# Altium schematic sheet v1.0.SchDoc
size 266 x 111 mm
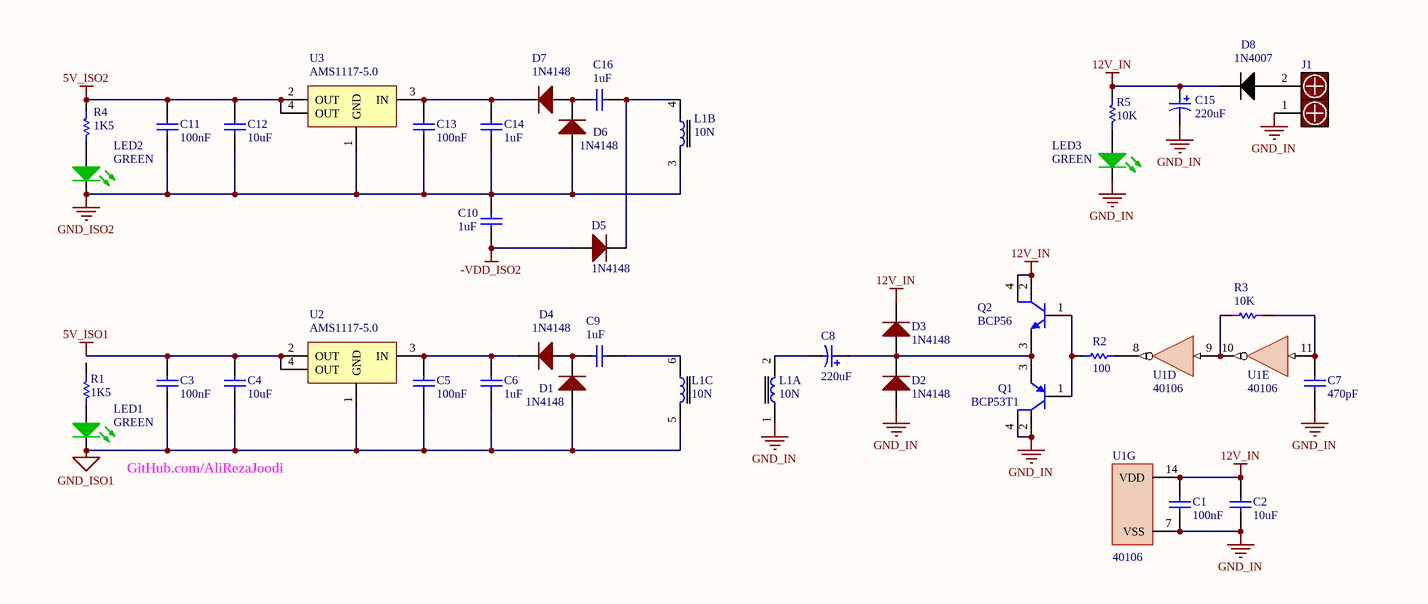
[diagram p0: v1.0.SchDoc]

## Parts
C1  100nF  [SMD_0805]
C2  10uF  [SMD_0805]
C3  100nF  [SMD_0805]
C4  10uF  [SMD_0805]
C5  100nF  [SMD_0805]
C6  1uF  [SMD_0805]
C7  470pF  [SMD_0805]
C8  220uF  [THD_P3.4/D8/H12]
C9  1uF  [SMD_0805]
C10  1uF  [SMD_0805]
C11  100nF  [SMD_0805]
C12  10uF  [SMD_0805]
C13  100nF  [SMD_0805]
C14  1uF  [SMD_0805]
C15  220uF  [THD_P3.4/D8/H12]
C16  1uF  [SMD_0805]
D1  1N4148  [SMD_DO-213AA]
D2  1N4148  [SMD_DO-213AA]
D3  1N4148  [SMD_DO-213AA]
D4  1N4148  [SMD_DO-213AA]
D5  1N4148  [SMD_DO-213AA]
D6  1N4148  [SMD_DO-213AA]
D7  1N4148  [SMD_DO-213AA]
D8  1N4007  [SMD_SOD123W]
J1  (no value)  [1x2_P8.26]
L1  10N  [TOROIDS_DO25/DI15/L13]  (parts A,B,C of 3)
LED1  GREEN  [SMD_0805_GREEN]
LED2  GREEN  [SMD_0805_GREEN]
LED3  GREEN  [SMD_0805_GREEN]
Q1  BCP53T1  [SOT223_4PIN]
Q2  BCP56  [SOT223_4PIN]
R1  1K5  [SMD_0805]
R2  100  [SMD_0805]
R3  10K  [SMD_0805]
R4  1K5  [SMD_0805]
R5  10K  [SMD_0805]
U1  40106  [SOIC127P600X175-14N]  (parts D,E,G of 7)
U2  AMS1117-5.0  [SOT223_4PIN]
U3  AMS1117-5.0  [SOT223_4PIN]

## Nets
5V_ISO1: C3.1 C4.1 U2.2(OUT) U2.4(OUT)
5V_ISO2: C11.1 C12.1 R4.2 U3.2(OUT) U3.4(OUT)
12V_IN: C1.2 C2.1 C15.1 D3.2(K) D8.2(K) Q2.2(C) Q2.4(C) R5.2 U1.14(VDD)
-VDD_ISO2: C10.1 D5.1(A)
GND_IN: C1.1 C2.2 C7.1 C15.2 D2.1(A) J1.1 L1.1 LED3.2(K) Q1.2(C) Q1.4(E) U1.7(VSS)
GND_ISO1: C3.2 C4.2 C5.2 C6.2 D1.1(A) L1.5 LED1.2(K) U2.1(GND)
GND_ISO2: C10.2 C11.2 C12.2 C13.2 C14.2 D6.1(A) L1.3 LED2.2(K) U3.1(GND)
NetC5_1: C5.1 C6.1 D4.2(K) U2.3(IN)
NetC7_2: C7.2 R3.1 U1.11(I)
NetC8_1: C8.1 D2.2(K) D3.1(A) Q1.3(E) Q2.3(E)
NetC8_2: C8.2 L1.2
NetC9_1: C9.1 L1.6
NetC9_2: C9.2 D1.2(K) D4.1(A)
NetC13_1: C13.1 C14.1 D7.2(K) U3.3(IN)
NetC16_1: C16.1 D5.2(K) L1.4
NetC16_2: C16.2 D6.2(K) D7.1(A)
NetD8_1: D8.1(A) J1.2
NetLED2_1: LED2.1(A) R4.1
NetLED3_1: LED3.1(A) R5.1
NetQ1_1: Q1.1(B) Q2.1(B) R2.1
NetR2_2: R2.2 U1.8(~{O})
NetR3_2: R3.2 U1.9(I) U1.10(~{O})

Not connected (* = marked no-connect by the designer): LED1 1(A); R1 1 2

## Notes on the sheet
- GitHub.com/AliRezaJoodi

## Library data of the parts
C1-C7 C9-C14 C16 = Capacitor_Ceramic: Capacitor, Ceramic Multilayer, 25V, 10%; Revision: July-2002: Re-released for DXP Platform.
C8 C15 = Capacitor_Electrolytic: Capacitor, Electrolytic, 25V, 10%; Revision: July-2002: Re-released for DXP Platform.
D1-D7 = Diode_2Form: Diode; Manufacturer: Microchip Technology; Part Number: 1N4148UR-1; Link: https://eu.mouser.com/ProductDetail/Microchip-Technology/1N4148UR-1?qs=%252BRKXB2WKlSdXiNZTe6I9fg%3D%3D
D8 = 1N4007: Diode; Manufacturer: SMC Diode Solutions; Part Number: 1N4007FL; Link: https://www.digikey.com/en/products/detail/smc-diode-solutions/1N4007FL/11657817?s=N4IgTCBcDaIIwDkAsAGFB2AYgGRAXQF8g
J1 = Connector1x2_Power_4Form: Connector, Barrier Terminal Blocks, 2Pin; 1_Manufacturer: TE Connectivity; 1_Part Number: 1977477-2; 1_Link: https://eu.mouser.com/ProductDetail/TE-Connectivity/1977477-2?qs=94mdU9cNTDpZiO77z39FFw%3D%3D
L1 = Inductor_Trans_3Wire_2Form: Power Transformer, Ferrite Toroids; Manufacturer: TDK; Part Number: HF70T25X13X15; Link: https://eu.mouser.com/ProductDetail/TDK/HF70T25X13X15?qs=mVvrpt%2FmFGYyYHELlsZGzA%3D%3D
LED1-LED3 = LED_GREEN: LED; Revision: July-2002: Re-released for DXP Platform.
Q1 = Transistor_BJT_PNP_bcec: Transistor, BJT, PNP; Manufacturer: ON Semiconductor; Part Number: BCP53T1G; Link: https://eu.mouser.com/ProductDetail/onsemi/BCP53T1G?qs=vNc2DXHODiIiUesRkQLOnQ%3D%3D
Q2 = Transistor_BJT_NPN_bcec: Transistor, BJT, NPN; Part Number: BCP56-16T1G; Manufacturer: ON Semiconductor; Link: https://eu.mouser.com/ProductDetail/onsemi/BCP56-16T1G?qs=vNc2DXHODiJjvgZ7tStiKQ%3D%3D
R1-R5 = Resistor: Resistor, 1/8W, 5%; Revision: July-2002: Re-released for DXP Platform.
  R2: Tolerance: 5%; Power: 1/8W
U1 = 40106: Hex inverting Schmitt trigger; Manufacturer: Texas Instruments; Part Number: CD40106BM96; Link: https://eu.mouser.com/ProductDetail/Texas-Instruments/CD40106BM96?qs=JHHQeKcAU3BBPrs16F1q0Q%3D%3D
U2 = AMS1117: Low Dropout Linear Regulator; Part Number: LM1117IMP-5.0/NOPB; Manufacturer: Texas Instruments; Link: https://eu.mouser.com/ProductDetail/Texas-Instruments/LM1117IMP-5.0-NOPB?qs=X1J7HmVL2ZHO6cZ9lqve%252BA%3D%3D
U3 = AMS1117: Low Dropout Linear Regulator; Manufacturer: Texas Instruments; Part Number: LM1117IMP-5.0/NOPB; Link: https://eu.mouser.com/ProductDetail/Texas-Instruments/LM1117IMP-5.0-NOPB?qs=X1J7HmVL2ZHO6cZ9lqve%252BA%3D%3D